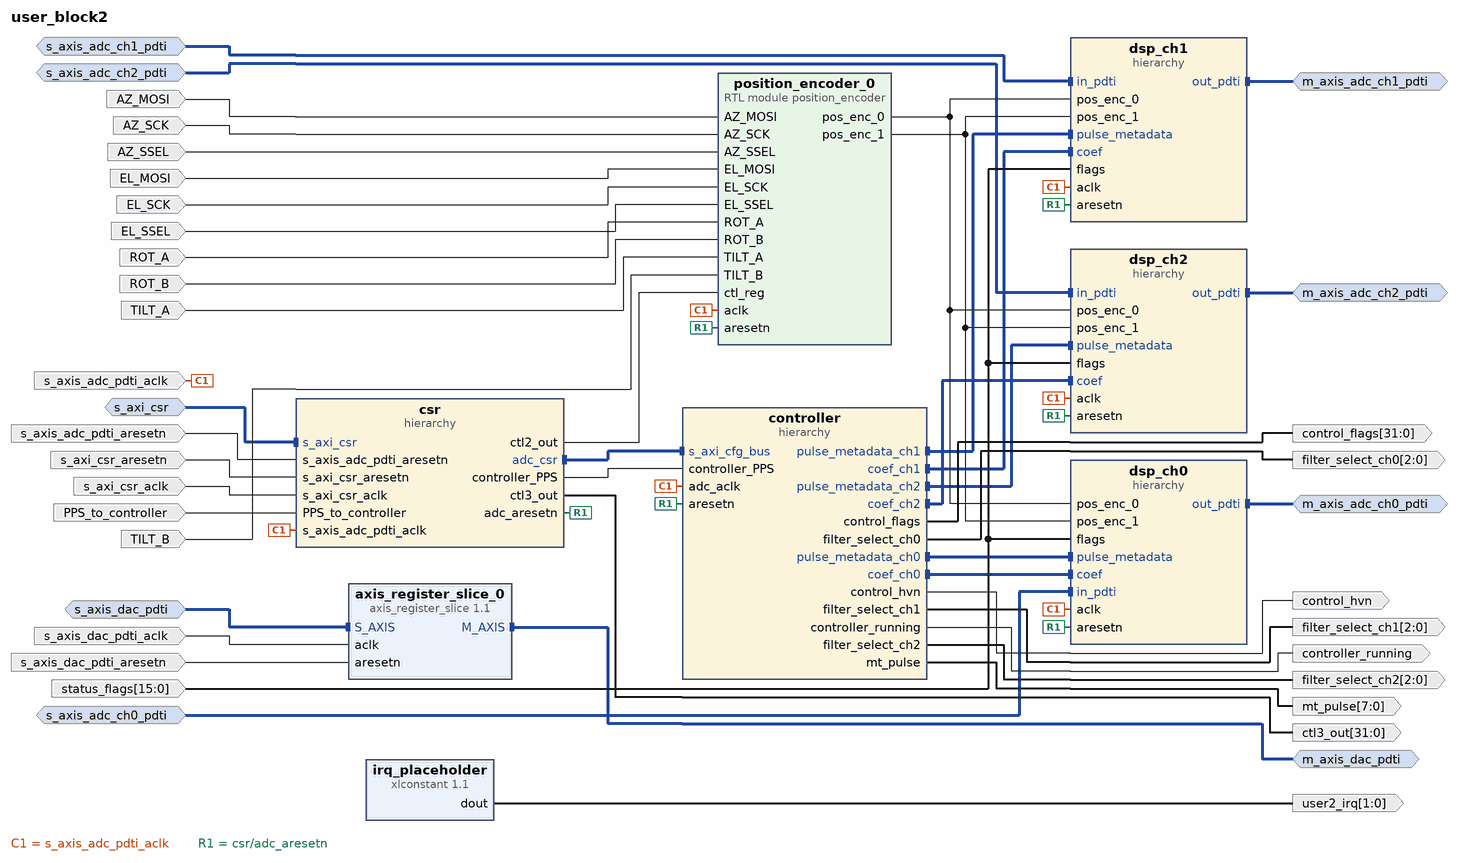
[diagram p0: block diagram of the top level]
# Vivado block design user_block2, xcku060-ffva1156-2-e, Vivado 2019.2
create_bd_design user_block2

create_bd_intf_port -mode Master -vlnv xilinx.com:interface:axis_rtl:1.0 m_axis_adc_ch0_pdti
set_property -dict [list \
  CONFIG.FREQ_HZ 200000000 \
  CONFIG.CLK_DOMAIN user_block2_s_axis_adc_pdti_aclk \
] [get_bd_intf_ports m_axis_adc_ch0_pdti]
create_bd_intf_port -mode Slave -vlnv xilinx.com:interface:axis_rtl:1.0 s_axis_adc_ch0_pdti
set_property -dict [list \
  CONFIG.TDATA_NUM_BYTES 4 \
  CONFIG.TDEST_WIDTH 0 \
  CONFIG.TID_WIDTH 0 \
  CONFIG.TUSER_WIDTH 128 \
  CONFIG.HAS_TREADY 0 \
  CONFIG.HAS_TSTRB 0 \
  CONFIG.HAS_TKEEP 0 \
  CONFIG.HAS_TLAST 0 \
  CONFIG.FREQ_HZ 200000000 \
  CONFIG.CLK_DOMAIN user_block2_s_axis_adc_pdti_aclk \
  CONFIG.LAYERED_METADATA undef \
] [get_bd_intf_ports s_axis_adc_ch0_pdti]
create_bd_intf_port -mode Slave -vlnv xilinx.com:interface:aximm_rtl:1.0 s_axi_csr
set_property -dict [list \
  CONFIG.DATA_WIDTH 32 \
  CONFIG.PROTOCOL AXI4LITE \
  CONFIG.FREQ_HZ 250000000 \
  CONFIG.ID_WIDTH 0 \
  CONFIG.ADDR_WIDTH 26 \
  CONFIG.AWUSER_WIDTH 0 \
  CONFIG.ARUSER_WIDTH 0 \
  CONFIG.WUSER_WIDTH 0 \
  CONFIG.RUSER_WIDTH 0 \
  CONFIG.BUSER_WIDTH 0 \
  CONFIG.READ_WRITE_MODE READ_WRITE \
  CONFIG.HAS_BURST 0 \
  CONFIG.HAS_LOCK 0 \
  CONFIG.HAS_PROT 1 \
  CONFIG.HAS_CACHE 0 \
  CONFIG.HAS_QOS 0 \
  CONFIG.HAS_REGION 0 \
  CONFIG.HAS_WSTRB 1 \
  CONFIG.HAS_BRESP 1 \
  CONFIG.HAS_RRESP 1 \
  CONFIG.SUPPORTS_NARROW_BURST 0 \
  CONFIG.NUM_READ_OUTSTANDING 1 \
  CONFIG.NUM_WRITE_OUTSTANDING 1 \
  CONFIG.MAX_BURST_LENGTH 1 \
  CONFIG.NUM_READ_THREADS 1 \
  CONFIG.NUM_WRITE_THREADS 1 \
  CONFIG.RUSER_BITS_PER_BYTE 0 \
  CONFIG.WUSER_BITS_PER_BYTE 0 \
] [get_bd_intf_ports s_axi_csr]
create_bd_intf_port -mode Master -vlnv xilinx.com:interface:axis_rtl:1.0 m_axis_adc_ch1_pdti
set_property -dict [list \
  CONFIG.FREQ_HZ 200000000 \
  CONFIG.CLK_DOMAIN user_block2_s_axis_adc_pdti_aclk \
] [get_bd_intf_ports m_axis_adc_ch1_pdti]
create_bd_intf_port -mode Slave -vlnv xilinx.com:interface:axis_rtl:1.0 s_axis_adc_ch1_pdti
set_property -dict [list \
  CONFIG.TDATA_NUM_BYTES 4 \
  CONFIG.TDEST_WIDTH 0 \
  CONFIG.TID_WIDTH 0 \
  CONFIG.TUSER_WIDTH 128 \
  CONFIG.HAS_TREADY 0 \
  CONFIG.HAS_TSTRB 0 \
  CONFIG.HAS_TKEEP 0 \
  CONFIG.HAS_TLAST 0 \
  CONFIG.FREQ_HZ 200000000 \
  CONFIG.CLK_DOMAIN user_block2_s_axis_adc_pdti_aclk \
  CONFIG.LAYERED_METADATA undef \
] [get_bd_intf_ports s_axis_adc_ch1_pdti]
create_bd_intf_port -mode Master -vlnv xilinx.com:interface:axis_rtl:1.0 m_axis_adc_ch2_pdti
set_property -dict [list \
  CONFIG.FREQ_HZ 200000000 \
  CONFIG.CLK_DOMAIN user_block2_s_axis_adc_pdti_aclk \
] [get_bd_intf_ports m_axis_adc_ch2_pdti]
create_bd_intf_port -mode Slave -vlnv xilinx.com:interface:axis_rtl:1.0 s_axis_adc_ch2_pdti
set_property -dict [list \
  CONFIG.TDATA_NUM_BYTES 4 \
  CONFIG.TDEST_WIDTH 0 \
  CONFIG.TID_WIDTH 0 \
  CONFIG.TUSER_WIDTH 128 \
  CONFIG.HAS_TREADY 0 \
  CONFIG.HAS_TSTRB 0 \
  CONFIG.HAS_TKEEP 0 \
  CONFIG.HAS_TLAST 0 \
  CONFIG.FREQ_HZ 200000000 \
  CONFIG.CLK_DOMAIN user_block2_s_axis_adc_pdti_aclk \
  CONFIG.LAYERED_METADATA undef \
] [get_bd_intf_ports s_axis_adc_ch2_pdti]
create_bd_intf_port -mode Master -vlnv xilinx.com:interface:axis_rtl:1.0 m_axis_dac_pdti
set_property -dict [list \
  CONFIG.FREQ_HZ 250000000 \
  CONFIG.CLK_DOMAIN user_block2_s_axis_dac_pdti_aclk \
] [get_bd_intf_ports m_axis_dac_pdti]
create_bd_intf_port -mode Slave -vlnv xilinx.com:interface:axis_rtl:1.0 s_axis_dac_pdti
set_property -dict [list \
  CONFIG.TDATA_NUM_BYTES 4 \
  CONFIG.TDEST_WIDTH 0 \
  CONFIG.TID_WIDTH 0 \
  CONFIG.TUSER_WIDTH 128 \
  CONFIG.HAS_TREADY 0 \
  CONFIG.HAS_TSTRB 0 \
  CONFIG.HAS_TKEEP 0 \
  CONFIG.HAS_TLAST 0 \
  CONFIG.FREQ_HZ 250000000 \
  CONFIG.CLK_DOMAIN user_block2_s_axis_dac_pdti_aclk \
  CONFIG.LAYERED_METADATA undef \
] [get_bd_intf_ports s_axis_dac_pdti]
create_bd_port -dir O -from 1 -to 0 user2_irq
create_bd_port -dir I -type clk s_axis_adc_pdti_aclk
set_property -dict [list \
  CONFIG.ASSOCIATED_BUSIF s_axis_adc_ch1_pdti:s_axis_adc_ch2_pdti:m_axis_adc_ch0_pdti:m_axis_adc_ch1_pdti:m_axis_adc_ch2_pdti:s_axis_adc_ch0_pdti \
  CONFIG.ASSOCIATED_RESET s_axis_adc_pdti_aresetn \
  CONFIG.CLK_DOMAIN user_block2_s_axis_adc_pdti_aclk \
  CONFIG.FREQ_HZ 200000000 \
] [get_bd_ports s_axis_adc_pdti_aclk]
create_bd_port -dir O -from 2 -to 0 -type data filter_select_ch0
create_bd_port -dir O -from 2 -to 0 -type data filter_select_ch1
create_bd_port -dir O -from 2 -to 0 -type data filter_select_ch2
create_bd_port -dir O -from 31 -to 0 -type data control_flags
create_bd_port -dir O -from 7 -to 0 -type data mt_pulse
create_bd_port -dir I -from 15 -to 0 -type data status_flags
set_property -dict [list \
  CONFIG.LAYERED_METADATA {xilinx.com:interface:datatypes:1.0 {DATA {datatype {name {attribs {resolve_type immediate dependency {} format string minimum {} maximum {}} value {}} bitwidth {attribs {resolve_type immediate dependency {} format long minimum {} maximum {}} value 32} bitoffset {attribs {resolve_type immediate dependency {} format long minimum {} maximum {}} value 0} integer {signed {attribs {resolve_type immediate dependency {} format bool minimum {} maximum {}} value false}}}}}} \
] [get_bd_ports status_flags]
create_bd_port -dir I -type rst s_axis_adc_pdti_aresetn
create_bd_port -dir I -type rst s_axi_csr_aresetn
create_bd_port -dir I -type clk s_axi_csr_aclk
set_property -dict [list \
  CONFIG.ASSOCIATED_BUSIF s_axi_csr \
  CONFIG.ASSOCIATED_RESET s_axi_csr_aresetn \
  CONFIG.FREQ_HZ 250000000 \
] [get_bd_ports s_axi_csr_aclk]
create_bd_port -dir I PPS_to_controller
create_bd_port -dir I AZ_MOSI
create_bd_port -dir I AZ_SCK
create_bd_port -dir I AZ_SSEL
create_bd_port -dir I EL_MOSI
create_bd_port -dir I EL_SCK
create_bd_port -dir I EL_SSEL
create_bd_port -dir I ROT_A
create_bd_port -dir I ROT_B
create_bd_port -dir I TILT_A
create_bd_port -dir I TILT_B
create_bd_port -dir I -type clk s_axis_dac_pdti_aclk
set_property -dict [list \
  CONFIG.ASSOCIATED_BUSIF s_axis_dac_pdti:m_axis_dac_pdti \
  CONFIG.ASSOCIATED_RESET s_axis_dac_pdti_aresetn \
  CONFIG.CLK_DOMAIN user_block2_s_axis_dac_pdti_aclk \
  CONFIG.FREQ_HZ 250000000 \
] [get_bd_ports s_axis_dac_pdti_aclk]
create_bd_port -dir I -type rst s_axis_dac_pdti_aresetn
create_bd_port -dir O -from 31 -to 0 ctl3_out
create_bd_port -dir O controller_running
create_bd_port -dir O -type data control_hvn

create_bd_cell -type hier dsp_ch0
create_bd_cell -type hier dsp_ch2
create_bd_cell -type hier controller
create_bd_cell -type hier csr
create_bd_cell -type module -reference position_encoder position_encoder_0
create_bd_cell -type hier dsp_ch1
create_bd_cell -type ip -vlnv xilinx.com:ip:axis_register_slice:1.1 axis_register_slice_0
create_bd_cell -type ip -vlnv xilinx.com:ip:xlconstant:1.1 irq_placeholder
set_property -dict {CONFIG.CONST_VAL 0 CONFIG.CONST_WIDTH 2} [get_bd_cells irq_placeholder]

# ---- hierarchy /dsp_ch0 ----
current_bd_instance /dsp_ch0
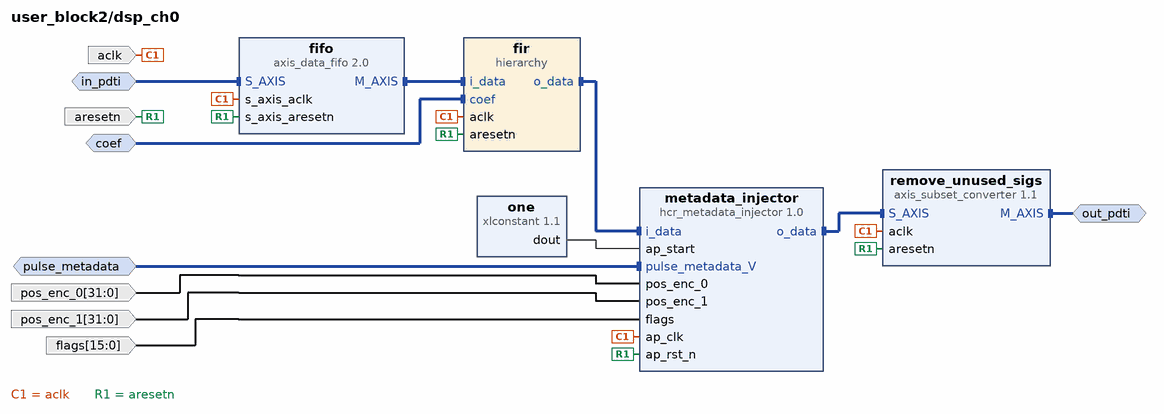
[diagram p1: block diagram inside /dsp_ch0]
create_bd_intf_pin -mode Master -vlnv xilinx.com:interface:axis_rtl:1.0 out_pdti
create_bd_intf_pin -mode Slave -vlnv xilinx.com:interface:axis_rtl:1.0 coef
create_bd_intf_pin -mode Slave -vlnv xilinx.com:interface:axis_rtl:1.0 in_pdti
create_bd_intf_pin -mode Slave -vlnv xilinx.com:interface:axis_rtl:1.0 pulse_metadata
create_bd_pin -dir I -type clk aclk
create_bd_pin -dir I -type rst aresetn
create_bd_pin -dir I -from 31 -to 0 -type data pos_enc_0
create_bd_pin -dir I -from 31 -to 0 -type data pos_enc_1
create_bd_pin -dir I -from 15 -to 0 -type data flags

create_bd_cell -type hier fir
create_bd_cell -type ip -vlnv xilinx.com:ip:axis_data_fifo:2.0 fifo
set_property -dict {CONFIG.FIFO_DEPTH 16 CONFIG.HAS_RD_DATA_COUNT 1 CONFIG.HAS_WR_DATA_COUNT 1} [get_bd_cells fifo]
create_bd_cell -type ip -vlnv xilinx.com:ip:axis_subset_converter:1.1 remove_unused_sigs
set_property -dict [list \
  CONFIG.M_HAS_TKEEP 0 \
  CONFIG.M_HAS_TLAST 0 \
  CONFIG.M_HAS_TREADY 0 \
  CONFIG.M_HAS_TSTRB 0 \
  CONFIG.M_TDEST_WIDTH 0 \
  CONFIG.M_TID_WIDTH 0 \
  CONFIG.TDATA_REMAP {tdata[31:0]} \
  CONFIG.TUSER_REMAP {tuser[127:0]} \
] [get_bd_cells remove_unused_sigs]
create_bd_cell -type ip -vlnv xilinx.com:ip:xlconstant:1.1 one
create_bd_cell -type ip -vlnv NCAR:EOL:hcr_metadata_injector:1.0 metadata_injector

# ---- hierarchy /dsp_ch0/fir ----
current_bd_instance /dsp_ch0/fir
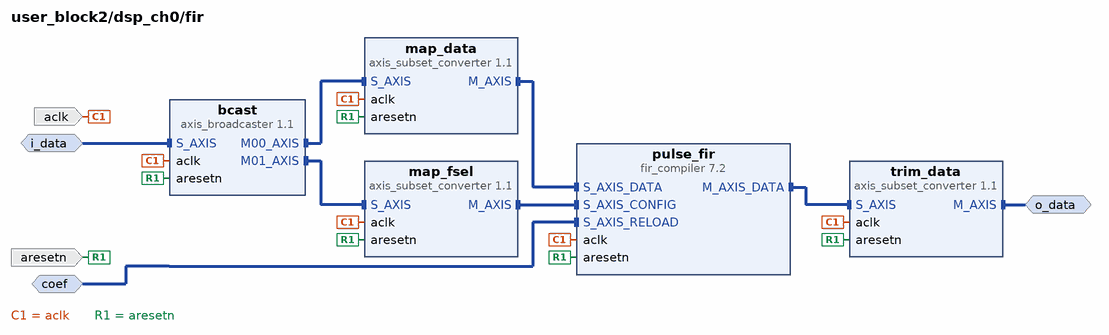
[diagram p2: block diagram inside /dsp_ch0/fir]
create_bd_intf_pin -mode Master -vlnv xilinx.com:interface:axis_rtl:1.0 o_data
create_bd_intf_pin -mode Slave -vlnv xilinx.com:interface:axis_rtl:1.0 coef
create_bd_intf_pin -mode Slave -vlnv xilinx.com:interface:axis_rtl:1.0 i_data
create_bd_pin -dir I -type clk aclk
create_bd_pin -dir I -type rst aresetn

create_bd_cell -type ip -vlnv xilinx.com:ip:axis_broadcaster:1.1 bcast
set_property -dict [list \
  CONFIG.M00_TDATA_REMAP {tdata[31:0]} \
  CONFIG.M00_TUSER_REMAP {tuser[127:0]} \
  CONFIG.M01_TDATA_REMAP {tdata[31:0]} \
  CONFIG.M01_TUSER_REMAP {tuser[127:0]} \
] [get_bd_cells bcast]
create_bd_cell -type ip -vlnv xilinx.com:ip:axis_subset_converter:1.1 map_fsel
set_property -dict [list \
  CONFIG.M_HAS_TKEEP 0 \
  CONFIG.M_HAS_TLAST 0 \
  CONFIG.M_HAS_TREADY 1 \
  CONFIG.M_HAS_TSTRB 0 \
  CONFIG.M_TDATA_NUM_BYTES 1 \
  CONFIG.M_TDEST_WIDTH 0 \
  CONFIG.M_TID_WIDTH 0 \
  CONFIG.M_TUSER_WIDTH 0 \
  CONFIG.S_HAS_TKEEP 0 \
  CONFIG.S_HAS_TLAST 0 \
  CONFIG.S_HAS_TREADY 1 \
  CONFIG.S_HAS_TSTRB 0 \
  CONFIG.S_TDATA_NUM_BYTES 4 \
  CONFIG.S_TDEST_WIDTH 0 \
  CONFIG.S_TID_WIDTH 0 \
  CONFIG.S_TUSER_WIDTH 128 \
  CONFIG.TDATA_REMAP {5'b0,tuser[31:29]} \
  CONFIG.TUSER_REMAP {1'b0} \
] [get_bd_cells map_fsel]
create_bd_cell -type ip -vlnv xilinx.com:ip:axis_subset_converter:1.1 trim_data
set_property -dict [list \
  CONFIG.M_TDATA_NUM_BYTES 4 \
  CONFIG.S_TDATA_NUM_BYTES 6 \
  CONFIG.TDATA_REMAP {tdata[39:24],tdata[15:0]} \
  CONFIG.TUSER_REMAP {tuser[127:0]} \
] [get_bd_cells trim_data]
create_bd_cell -type ip -vlnv xilinx.com:ip:axis_subset_converter:1.1 map_data
set_property -dict [list \
  CONFIG.M_HAS_TKEEP 0 \
  CONFIG.M_HAS_TLAST 0 \
  CONFIG.M_HAS_TREADY 1 \
  CONFIG.M_HAS_TSTRB 0 \
  CONFIG.M_TDATA_NUM_BYTES 4 \
  CONFIG.M_TDEST_WIDTH 0 \
  CONFIG.M_TID_WIDTH 0 \
  CONFIG.M_TUSER_WIDTH 128 \
  CONFIG.S_HAS_TKEEP 0 \
  CONFIG.S_HAS_TLAST 0 \
  CONFIG.S_HAS_TREADY 1 \
  CONFIG.S_HAS_TSTRB 0 \
  CONFIG.S_TDATA_NUM_BYTES 4 \
  CONFIG.S_TDEST_WIDTH 0 \
  CONFIG.S_TID_WIDTH 0 \
  CONFIG.S_TUSER_WIDTH 128 \
  CONFIG.TDATA_REMAP {tdata[31:0]} \
  CONFIG.TUSER_REMAP {tuser[127:32],3'b0,tuser[28:0]} \
] [get_bd_cells map_data]
create_bd_cell -type ip -vlnv xilinx.com:ip:fir_compiler:7.2 pulse_fir
set_property -dict [list \
  CONFIG.Blank_Output false \
  CONFIG.CoefficientVector 1,1,1,1,1,1,1,1,1,1,1,1,1,1,1,1,1,1,1,1,1,1,1,1,1,1,1,1,1,1,1,1,1,1,1,1,1,1,1,1,1,1,1,1,1,1,1,1,1,1,1,1,1,1,1,1,1,1,1,1,1,1,1,1,1,1,1,1,1,1,1,1,1,1,1,1,1,1,1,1,1,1,1,1,1,1,1,1,1,1,1,1,1,1,1,1,1,1,1,1,1,1,1,1,1,1,1,1,1,1,1,1,1,1,1,1,1,1,1,1,1,1,1,1,1,1,1,1,1,1,1,1,1,1,1,1,1,1,1,1,1,1,1,1,1,1,1,1,1,1,1,1,1,1,1,1,1,1,1,1,1,1,1,1,1,1,1,1,1,1,1,1,1,1,1,1,1,1,1,1,1,1,1,1,1,1,1,1,1,1,1,1,1,1,1,1,1,1,1,1,1,1,1,1,1,1,1,1,1,1,1,1,1,1,1,1,1,1,1,1,1,1,1,1,1,1,1,1,1,1,1,1,1,1,1,1,1,1,1,1,1,1,1,1,1,1,1,1,1,1,1,1,1,1,1,1,1,1,1,1,1,1,1,1,1,1,1,1,1,1,1,1,1,1,1,1,1,1,1,1,1,1,1,1,1,1,1,1,1,1,1,1,1,1,1,1,1,1,1,1,1,1,1,1,1,1,1,1,1,1,1,1,1,1,1,1,1,1,1,1,1,1,1,1,1,1,1,1,1,1,1,1,1,1,1,1,1,1,1,1,1,1,1,1,1,1,1,1,1,1,1,1,1,1,1,1,1,1,1,1,1,1,1,1,1,1,1,1,1,1,1,1,1,1,1,1,1,1,1,1,1,1,1,1 \
  CONFIG.Coefficient_Fractional_Bits 22 \
  CONFIG.Coefficient_Reload true \
  CONFIG.Coefficient_Sets 8 \
  CONFIG.Coefficient_Sign Signed \
  CONFIG.Coefficient_Structure Non_Symmetric \
  CONFIG.Coefficient_Width 24 \
  CONFIG.ColumnConfig 48 \
  CONFIG.DATA_Has_TLAST Not_Required \
  CONFIG.DATA_TUSER_Width 128 \
  CONFIG.Data_Fractional_Bits 15 \
  CONFIG.Data_Width 16 \
  CONFIG.DisplayReloadOrder true \
  CONFIG.Filter_Architecture Systolic_Multiply_Accumulate \
  CONFIG.Has_ARESETn true \
  CONFIG.M_DATA_Has_TREADY true \
  CONFIG.M_DATA_Has_TUSER User_Field \
  CONFIG.Num_Reload_Slots 4 \
  CONFIG.Number_Channels 1 \
  CONFIG.Number_Paths 2 \
  CONFIG.Output_Rounding_Mode Symmetric_Rounding_to_Zero \
  CONFIG.Output_Width 24 \
  CONFIG.Quantization Quantize_Only \
  CONFIG.RateSpecification Input_Sample_Period \
  CONFIG.Reset_Data_Vector true \
  CONFIG.S_DATA_Has_FIFO true \
  CONFIG.S_DATA_Has_TUSER User_Field \
  CONFIG.SamplePeriod 1 \
  CONFIG.Select_Pattern All \
] [get_bd_cells pulse_fir]

# ---- hierarchy /dsp_ch2 ----
current_bd_instance /dsp_ch2
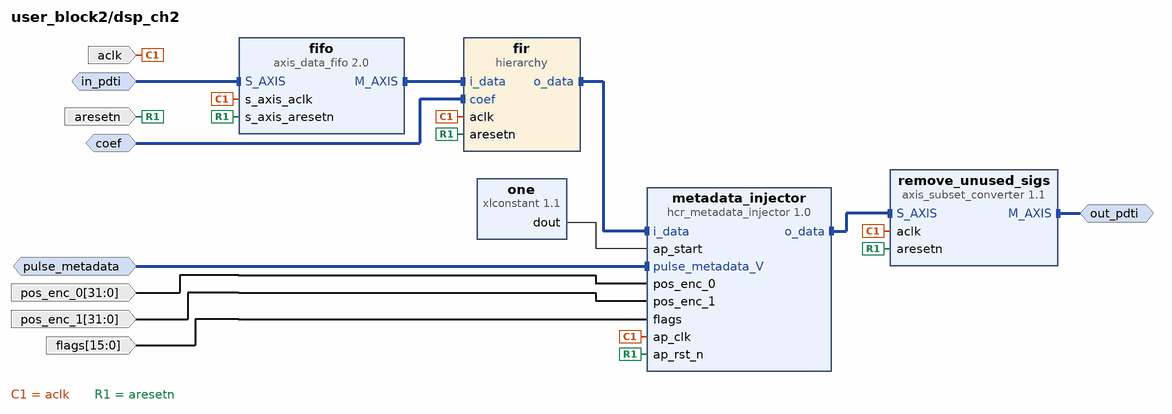
[diagram p3: block diagram inside /dsp_ch2]
create_bd_intf_pin -mode Master -vlnv xilinx.com:interface:axis_rtl:1.0 out_pdti
create_bd_intf_pin -mode Slave -vlnv xilinx.com:interface:axis_rtl:1.0 coef
create_bd_intf_pin -mode Slave -vlnv xilinx.com:interface:axis_rtl:1.0 in_pdti
create_bd_intf_pin -mode Slave -vlnv xilinx.com:interface:axis_rtl:1.0 pulse_metadata
create_bd_pin -dir I -type clk aclk
create_bd_pin -dir I -type rst aresetn
create_bd_pin -dir I -from 31 -to 0 -type data pos_enc_0
create_bd_pin -dir I -from 31 -to 0 -type data pos_enc_1
create_bd_pin -dir I -from 15 -to 0 -type data flags

create_bd_cell -type hier fir
create_bd_cell -type ip -vlnv xilinx.com:ip:axis_subset_converter:1.1 remove_unused_sigs
set_property -dict [list \
  CONFIG.M_HAS_TKEEP 0 \
  CONFIG.M_HAS_TLAST 0 \
  CONFIG.M_HAS_TREADY 0 \
  CONFIG.M_HAS_TSTRB 0 \
  CONFIG.M_TDEST_WIDTH 0 \
  CONFIG.M_TID_WIDTH 0 \
  CONFIG.TDATA_REMAP {tdata[31:0]} \
  CONFIG.TUSER_REMAP {tuser[127:0]} \
] [get_bd_cells remove_unused_sigs]
create_bd_cell -type ip -vlnv xilinx.com:ip:axis_data_fifo:2.0 fifo
set_property -dict {CONFIG.FIFO_DEPTH 16 CONFIG.HAS_RD_DATA_COUNT 1 CONFIG.HAS_WR_DATA_COUNT 1} [get_bd_cells fifo]
create_bd_cell -type ip -vlnv xilinx.com:ip:xlconstant:1.1 one
create_bd_cell -type ip -vlnv NCAR:EOL:hcr_metadata_injector:1.0 metadata_injector

# ---- hierarchy /dsp_ch2/fir ----
current_bd_instance /dsp_ch2/fir
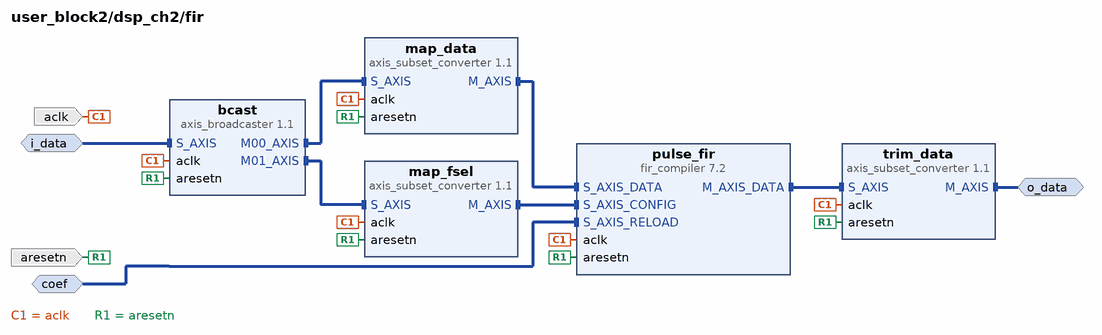
[diagram p4: block diagram inside /dsp_ch2/fir]
create_bd_intf_pin -mode Master -vlnv xilinx.com:interface:axis_rtl:1.0 o_data
create_bd_intf_pin -mode Slave -vlnv xilinx.com:interface:axis_rtl:1.0 coef
create_bd_intf_pin -mode Slave -vlnv xilinx.com:interface:axis_rtl:1.0 i_data
create_bd_pin -dir I -type clk aclk
create_bd_pin -dir I -type rst aresetn

create_bd_cell -type ip -vlnv xilinx.com:ip:axis_subset_converter:1.1 trim_data
set_property -dict [list \
  CONFIG.M_TDATA_NUM_BYTES 4 \
  CONFIG.S_TDATA_NUM_BYTES 6 \
  CONFIG.TDATA_REMAP {tdata[39:24],tdata[15:0]} \
  CONFIG.TUSER_REMAP {tuser[127:0]} \
] [get_bd_cells trim_data]
create_bd_cell -type ip -vlnv xilinx.com:ip:axis_broadcaster:1.1 bcast
set_property -dict [list \
  CONFIG.M00_TDATA_REMAP {tdata[31:0]} \
  CONFIG.M00_TUSER_REMAP {tuser[127:0]} \
  CONFIG.M01_TDATA_REMAP {tdata[31:0]} \
  CONFIG.M01_TUSER_REMAP {tuser[127:0]} \
] [get_bd_cells bcast]
create_bd_cell -type ip -vlnv xilinx.com:ip:axis_subset_converter:1.1 map_fsel
set_property -dict [list \
  CONFIG.M_HAS_TKEEP 0 \
  CONFIG.M_HAS_TLAST 0 \
  CONFIG.M_HAS_TREADY 1 \
  CONFIG.M_HAS_TSTRB 0 \
  CONFIG.M_TDATA_NUM_BYTES 1 \
  CONFIG.M_TDEST_WIDTH 0 \
  CONFIG.M_TID_WIDTH 0 \
  CONFIG.M_TUSER_WIDTH 0 \
  CONFIG.S_HAS_TKEEP 0 \
  CONFIG.S_HAS_TLAST 0 \
  CONFIG.S_HAS_TREADY 1 \
  CONFIG.S_HAS_TSTRB 0 \
  CONFIG.S_TDATA_NUM_BYTES 4 \
  CONFIG.S_TDEST_WIDTH 0 \
  CONFIG.S_TID_WIDTH 0 \
  CONFIG.S_TUSER_WIDTH 128 \
  CONFIG.TDATA_REMAP {5'b0,tuser[31:29]} \
  CONFIG.TUSER_REMAP {1'b0} \
] [get_bd_cells map_fsel]
create_bd_cell -type ip -vlnv xilinx.com:ip:axis_subset_converter:1.1 map_data
set_property -dict [list \
  CONFIG.M_HAS_TKEEP 0 \
  CONFIG.M_HAS_TLAST 0 \
  CONFIG.M_HAS_TREADY 1 \
  CONFIG.M_HAS_TSTRB 0 \
  CONFIG.M_TDATA_NUM_BYTES 4 \
  CONFIG.M_TDEST_WIDTH 0 \
  CONFIG.M_TID_WIDTH 0 \
  CONFIG.M_TUSER_WIDTH 128 \
  CONFIG.S_HAS_TKEEP 0 \
  CONFIG.S_HAS_TLAST 0 \
  CONFIG.S_HAS_TREADY 1 \
  CONFIG.S_HAS_TSTRB 0 \
  CONFIG.S_TDATA_NUM_BYTES 4 \
  CONFIG.S_TDEST_WIDTH 0 \
  CONFIG.S_TID_WIDTH 0 \
  CONFIG.S_TUSER_WIDTH 128 \
  CONFIG.TDATA_REMAP {tdata[31:0]} \
  CONFIG.TUSER_REMAP {tuser[127:32],3'b0,tuser[28:0]} \
] [get_bd_cells map_data]
create_bd_cell -type ip -vlnv xilinx.com:ip:fir_compiler:7.2 pulse_fir
set_property -dict [list \
  CONFIG.Blank_Output false \
  CONFIG.CoefficientVector 1,1,1,1,1,1,1,1,1,1,1,1,1,1,1,1,1,1,1,1,1,1,1,1,1,1,1,1,1,1,1,1,1,1,1,1,1,1,1,1,1,1,1,1,1,1,1,1,1,1,1,1,1,1,1,1,1,1,1,1,1,1,1,1,1,1,1,1,1,1,1,1,1,1,1,1,1,1,1,1,1,1,1,1,1,1,1,1,1,1,1,1,1,1,1,1,1,1,1,1,1,1,1,1,1,1,1,1,1,1,1,1,1,1,1,1,1,1,1,1,1,1,1,1,1,1,1,1,1,1,1,1,1,1,1,1,1,1,1,1,1,1,1,1,1,1,1,1,1,1,1,1,1,1,1,1,1,1,1,1,1,1,1,1,1,1,1,1,1,1,1,1,1,1,1,1,1,1,1,1,1,1,1,1,1,1,1,1,1,1,1,1,1,1,1,1,1,1,1,1,1,1,1,1,1,1,1,1,1,1,1,1,1,1,1,1,1,1,1,1,1,1,1,1,1,1,1,1,1,1,1,1,1,1,1,1,1,1,1,1,1,1,1,1,1,1,1,1,1,1,1,1,1,1,1,1,1,1,1,1,1,1,1,1,1,1,1,1,1,1,1,1,1,1,1,1,1,1,1,1,1,1,1,1,1,1,1,1,1,1,1,1,1,1,1,1,1,1,1,1,1,1,1,1,1,1,1,1,1,1,1,1,1,1,1,1,1,1,1,1,1,1,1,1,1,1,1,1,1,1,1,1,1,1,1,1,1,1,1,1,1,1,1,1,1,1,1,1,1,1,1,1,1,1,1,1,1,1,1,1,1,1,1,1,1,1,1,1,1,1,1,1,1,1,1,1,1,1,1,1,1,1,1,1 \
  CONFIG.Coefficient_Fractional_Bits 22 \
  CONFIG.Coefficient_Reload true \
  CONFIG.Coefficient_Sets 8 \
  CONFIG.Coefficient_Sign Signed \
  CONFIG.Coefficient_Structure Non_Symmetric \
  CONFIG.Coefficient_Width 24 \
  CONFIG.ColumnConfig 48 \
  CONFIG.DATA_Has_TLAST Not_Required \
  CONFIG.DATA_TUSER_Width 128 \
  CONFIG.Data_Fractional_Bits 15 \
  CONFIG.Data_Width 16 \
  CONFIG.DisplayReloadOrder true \
  CONFIG.Filter_Architecture Systolic_Multiply_Accumulate \
  CONFIG.Has_ARESETn true \
  CONFIG.M_DATA_Has_TREADY true \
  CONFIG.M_DATA_Has_TUSER User_Field \
  CONFIG.Num_Reload_Slots 4 \
  CONFIG.Number_Channels 1 \
  CONFIG.Number_Paths 2 \
  CONFIG.Output_Rounding_Mode Symmetric_Rounding_to_Zero \
  CONFIG.Output_Width 24 \
  CONFIG.Quantization Quantize_Only \
  CONFIG.RateSpecification Input_Sample_Period \
  CONFIG.Reset_Data_Vector true \
  CONFIG.S_DATA_Has_FIFO true \
  CONFIG.S_DATA_Has_TUSER User_Field \
  CONFIG.SamplePeriod 1 \
  CONFIG.Select_Pattern All \
] [get_bd_cells pulse_fir]

# ---- hierarchy /controller ----
current_bd_instance /controller
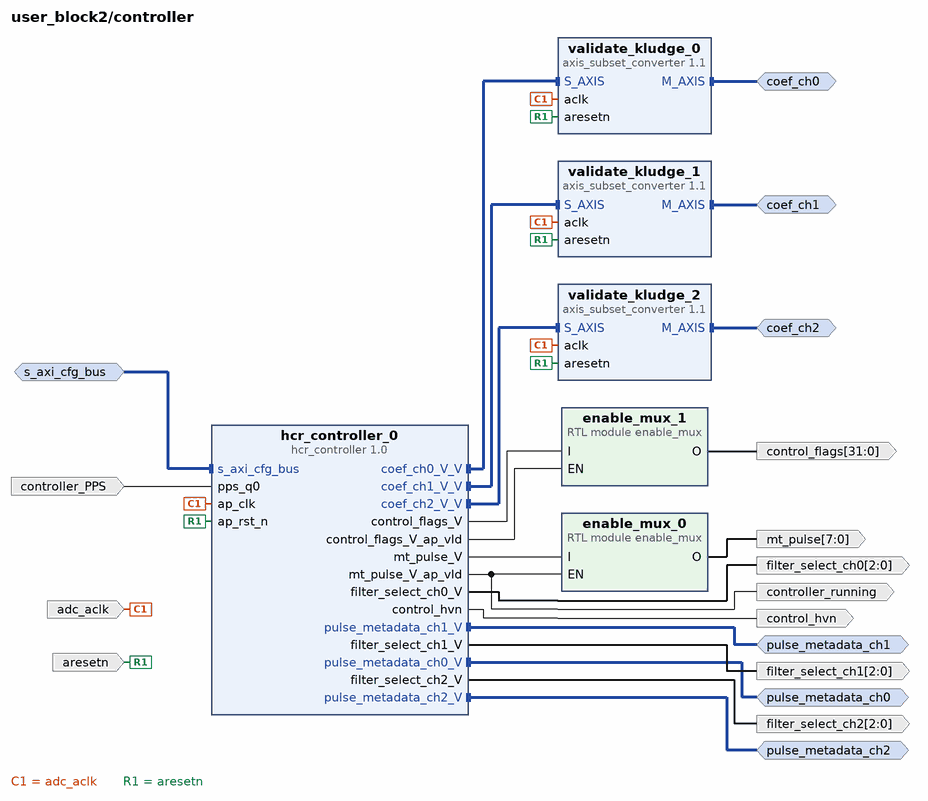
[diagram p5: block diagram inside /controller]
create_bd_intf_pin -mode Master -vlnv xilinx.com:interface:axis_rtl:1.0 coef_ch0
create_bd_intf_pin -mode Master -vlnv xilinx.com:interface:axis_rtl:1.0 coef_ch1
create_bd_intf_pin -mode Master -vlnv xilinx.com:interface:axis_rtl:1.0 coef_ch2
create_bd_intf_pin -mode Master -vlnv xilinx.com:interface:axis_rtl:1.0 pulse_metadata_ch0
create_bd_intf_pin -mode Master -vlnv xilinx.com:interface:axis_rtl:1.0 pulse_metadata_ch1
create_bd_intf_pin -mode Master -vlnv xilinx.com:interface:axis_rtl:1.0 pulse_metadata_ch2
create_bd_intf_pin -mode Slave -vlnv xilinx.com:interface:aximm_rtl:1.0 s_axi_cfg_bus
create_bd_pin -dir I -type clk adc_aclk
create_bd_pin -dir O -from 7 -to 0 -type data mt_pulse
create_bd_pin -dir O -from 31 -to 0 -type data control_flags
create_bd_pin -dir O -from 2 -to 0 -type data filter_select_ch0
create_bd_pin -dir O -from 2 -to 0 -type data filter_select_ch1
create_bd_pin -dir O -from 2 -to 0 -type data filter_select_ch2
create_bd_pin -dir I controller_PPS
create_bd_pin -dir I -type rst aresetn
create_bd_pin -dir O controller_running
create_bd_pin -dir O -type data control_hvn

create_bd_cell -type module -reference enable_mux enable_mux_0
set_property -dict {CONFIG.n 8} [get_bd_cells enable_mux_0]
create_bd_cell -type module -reference enable_mux enable_mux_1
create_bd_cell -type ip -vlnv xilinx.com:ip:axis_subset_converter:1.1 validate_kludge_0
set_property -dict {CONFIG.TDATA_REMAP {tdata[23:0]}} [get_bd_cells validate_kludge_0]
create_bd_cell -type ip -vlnv xilinx.com:ip:axis_subset_converter:1.1 validate_kludge_1
set_property -dict {CONFIG.TDATA_REMAP {tdata[23:0]}} [get_bd_cells validate_kludge_1]
create_bd_cell -type ip -vlnv xilinx.com:ip:axis_subset_converter:1.1 validate_kludge_2
set_property -dict {CONFIG.TDATA_REMAP {tdata[23:0]}} [get_bd_cells validate_kludge_2]
create_bd_cell -type ip -vlnv NCAR:EOL:hcr_controller:1.0 hcr_controller_0

# ---- hierarchy /csr ----
current_bd_instance /csr
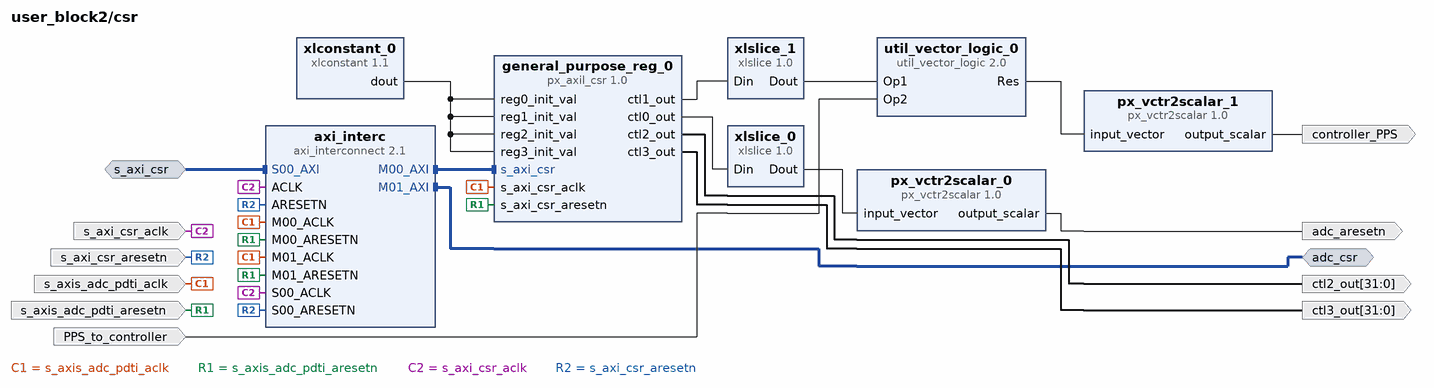
[diagram p6: block diagram inside /csr]
create_bd_intf_pin -mode Slave -vlnv xilinx.com:interface:aximm_rtl:1.0 s_axi_csr
create_bd_intf_pin -mode Master -vlnv xilinx.com:interface:aximm_rtl:1.0 adc_csr
create_bd_pin -dir I -type clk s_axis_adc_pdti_aclk
create_bd_pin -dir I -type rst s_axis_adc_pdti_aresetn
create_bd_pin -dir O adc_aresetn
create_bd_pin -dir I -type clk s_axi_csr_aclk
create_bd_pin -dir I -type rst s_axi_csr_aresetn
create_bd_pin -dir O controller_PPS
create_bd_pin -dir I PPS_to_controller
create_bd_pin -dir O -from 31 -to 0 ctl2_out
create_bd_pin -dir O -from 31 -to 0 ctl3_out

create_bd_cell -type ip -vlnv xilinx.com:ip:util_vector_logic:2.0 util_vector_logic_0
set_property -dict {CONFIG.C_OPERATION or CONFIG.C_SIZE 1} [get_bd_cells util_vector_logic_0]
create_bd_cell -type ip -vlnv xilinx.com:ip:axi_interconnect:2.1 axi_interc
set_property -dict [list \
  CONFIG.M00_HAS_REGSLICE 3 \
  CONFIG.M01_HAS_REGSLICE 3 \
  CONFIG.M02_HAS_REGSLICE 3 \
  CONFIG.M03_HAS_REGSLICE 3 \
  CONFIG.M04_HAS_REGSLICE 3 \
  CONFIG.NUM_MI 2 \
  CONFIG.S00_HAS_REGSLICE 1 \
  CONFIG.SYNCHRONIZATION_STAGES 2 \
] [get_bd_cells axi_interc]
create_bd_cell -type ip -vlnv pentek.com:px_ip:px_axil_csr:1.0 general_purpose_reg_0
set_property -dict [list \
  CONFIG.has_interrupt_regs false \
  CONFIG.num_ctl_regs 4 \
  CONFIG.num_stat_regs 0 \
] [get_bd_cells general_purpose_reg_0]
create_bd_cell -type ip -vlnv pentek.com:px_ip:px_vctr2scalar:1.0 px_vctr2scalar_0
set_property -dict {CONFIG.invert false} [get_bd_cells px_vctr2scalar_0]
create_bd_cell -type ip -vlnv pentek.com:px_ip:px_vctr2scalar:1.0 px_vctr2scalar_1
set_property -dict {CONFIG.invert false} [get_bd_cells px_vctr2scalar_1]
create_bd_cell -type ip -vlnv xilinx.com:ip:xlconstant:1.1 xlconstant_0
set_property -dict {CONFIG.CONST_VAL 0 CONFIG.CONST_WIDTH 32} [get_bd_cells xlconstant_0]
create_bd_cell -type ip -vlnv xilinx.com:ip:xlslice:1.0 xlslice_0
create_bd_cell -type ip -vlnv xilinx.com:ip:xlslice:1.0 xlslice_1

# ---- hierarchy /dsp_ch1 ----
current_bd_instance /dsp_ch1
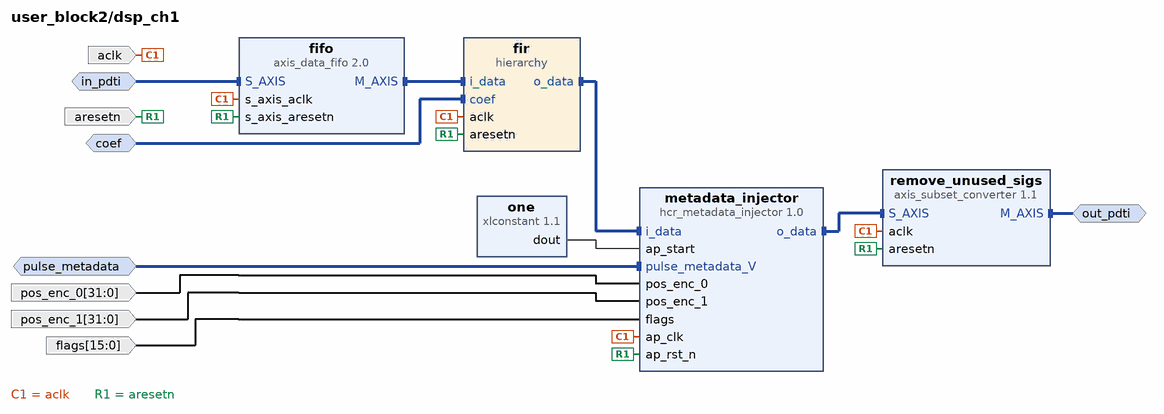
[diagram p7: block diagram inside /dsp_ch1]
create_bd_intf_pin -mode Master -vlnv xilinx.com:interface:axis_rtl:1.0 out_pdti
create_bd_intf_pin -mode Slave -vlnv xilinx.com:interface:axis_rtl:1.0 coef
create_bd_intf_pin -mode Slave -vlnv xilinx.com:interface:axis_rtl:1.0 in_pdti
create_bd_intf_pin -mode Slave -vlnv xilinx.com:interface:axis_rtl:1.0 pulse_metadata
create_bd_pin -dir I -type clk aclk
create_bd_pin -dir I -type rst aresetn
create_bd_pin -dir I -from 31 -to 0 -type data pos_enc_0
create_bd_pin -dir I -from 31 -to 0 -type data pos_enc_1
create_bd_pin -dir I -from 15 -to 0 -type data flags

create_bd_cell -type hier fir
create_bd_cell -type ip -vlnv xilinx.com:ip:axis_subset_converter:1.1 remove_unused_sigs
set_property -dict [list \
  CONFIG.M_HAS_TKEEP 0 \
  CONFIG.M_HAS_TLAST 0 \
  CONFIG.M_HAS_TREADY 0 \
  CONFIG.M_HAS_TSTRB 0 \
  CONFIG.M_TDEST_WIDTH 0 \
  CONFIG.M_TID_WIDTH 0 \
  CONFIG.TDATA_REMAP {tdata[31:0]} \
  CONFIG.TUSER_REMAP {tuser[127:0]} \
] [get_bd_cells remove_unused_sigs]
create_bd_cell -type ip -vlnv xilinx.com:ip:axis_data_fifo:2.0 fifo
set_property -dict {CONFIG.FIFO_DEPTH 16 CONFIG.HAS_RD_DATA_COUNT 1 CONFIG.HAS_WR_DATA_COUNT 1} [get_bd_cells fifo]
create_bd_cell -type ip -vlnv xilinx.com:ip:xlconstant:1.1 one
create_bd_cell -type ip -vlnv NCAR:EOL:hcr_metadata_injector:1.0 metadata_injector

# ---- hierarchy /dsp_ch1/fir ----
current_bd_instance /dsp_ch1/fir
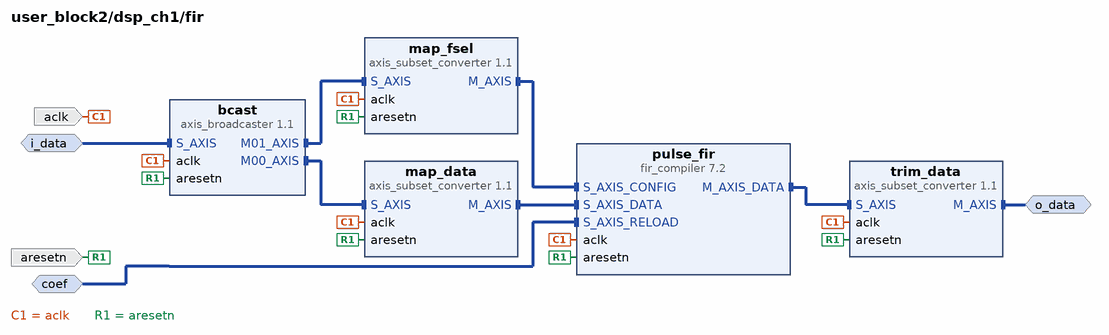
[diagram p8: block diagram inside /dsp_ch1/fir]
create_bd_intf_pin -mode Slave -vlnv xilinx.com:interface:axis_rtl:1.0 coef
create_bd_intf_pin -mode Slave -vlnv xilinx.com:interface:axis_rtl:1.0 i_data
create_bd_intf_pin -mode Master -vlnv xilinx.com:interface:axis_rtl:1.0 o_data
create_bd_pin -dir I -type clk aclk
create_bd_pin -dir I -type rst aresetn

create_bd_cell -type ip -vlnv xilinx.com:ip:axis_subset_converter:1.1 trim_data
set_property -dict [list \
  CONFIG.M_TDATA_NUM_BYTES 4 \
  CONFIG.S_TDATA_NUM_BYTES 6 \
  CONFIG.TDATA_REMAP {tdata[39:24],tdata[15:0]} \
  CONFIG.TUSER_REMAP {tuser[127:0]} \
] [get_bd_cells trim_data]
create_bd_cell -type ip -vlnv xilinx.com:ip:axis_broadcaster:1.1 bcast
set_property -dict [list \
  CONFIG.M00_TDATA_REMAP {tdata[31:0]} \
  CONFIG.M00_TUSER_REMAP {tuser[127:0]} \
  CONFIG.M01_TDATA_REMAP {tdata[31:0]} \
  CONFIG.M01_TUSER_REMAP {tuser[127:0]} \
] [get_bd_cells bcast]
create_bd_cell -type ip -vlnv xilinx.com:ip:axis_subset_converter:1.1 map_fsel
set_property -dict [list \
  CONFIG.M_HAS_TKEEP 0 \
  CONFIG.M_HAS_TLAST 0 \
  CONFIG.M_HAS_TREADY 1 \
  CONFIG.M_HAS_TSTRB 0 \
  CONFIG.M_TDATA_NUM_BYTES 1 \
  CONFIG.M_TDEST_WIDTH 0 \
  CONFIG.M_TID_WIDTH 0 \
  CONFIG.M_TUSER_WIDTH 0 \
  CONFIG.S_HAS_TKEEP 0 \
  CONFIG.S_HAS_TLAST 0 \
  CONFIG.S_HAS_TREADY 1 \
  CONFIG.S_HAS_TSTRB 0 \
  CONFIG.S_TDATA_NUM_BYTES 4 \
  CONFIG.S_TDEST_WIDTH 0 \
  CONFIG.S_TID_WIDTH 0 \
  CONFIG.S_TUSER_WIDTH 128 \
  CONFIG.TDATA_REMAP {5'b0,tuser[31:29]} \
  CONFIG.TUSER_REMAP {1'b0} \
] [get_bd_cells map_fsel]
create_bd_cell -type ip -vlnv xilinx.com:ip:axis_subset_converter:1.1 map_data
set_property -dict [list \
  CONFIG.M_HAS_TKEEP 0 \
  CONFIG.M_HAS_TLAST 0 \
  CONFIG.M_HAS_TREADY 1 \
  CONFIG.M_HAS_TSTRB 0 \
  CONFIG.M_TDATA_NUM_BYTES 4 \
  CONFIG.M_TDEST_WIDTH 0 \
  CONFIG.M_TID_WIDTH 0 \
  CONFIG.M_TUSER_WIDTH 128 \
  CONFIG.S_HAS_TKEEP 0 \
  CONFIG.S_HAS_TLAST 0 \
  CONFIG.S_HAS_TREADY 1 \
  CONFIG.S_HAS_TSTRB 0 \
  CONFIG.S_TDATA_NUM_BYTES 4 \
  CONFIG.S_TDEST_WIDTH 0 \
  CONFIG.S_TID_WIDTH 0 \
  CONFIG.S_TUSER_WIDTH 128 \
  CONFIG.TDATA_REMAP {tdata[31:0]} \
  CONFIG.TUSER_REMAP {tuser[127:32],3'b0,tuser[28:0]} \
] [get_bd_cells map_data]
create_bd_cell -type ip -vlnv xilinx.com:ip:fir_compiler:7.2 pulse_fir
set_property -dict [list \
  CONFIG.Blank_Output false \
  CONFIG.CoefficientVector 1,1,1,1,1,1,1,1,1,1,1,1,1,1,1,1,1,1,1,1,1,1,1,1,1,1,1,1,1,1,1,1,1,1,1,1,1,1,1,1,1,1,1,1,1,1,1,1,1,1,1,1,1,1,1,1,1,1,1,1,1,1,1,1,1,1,1,1,1,1,1,1,1,1,1,1,1,1,1,1,1,1,1,1,1,1,1,1,1,1,1,1,1,1,1,1,1,1,1,1,1,1,1,1,1,1,1,1,1,1,1,1,1,1,1,1,1,1,1,1,1,1,1,1,1,1,1,1,1,1,1,1,1,1,1,1,1,1,1,1,1,1,1,1,1,1,1,1,1,1,1,1,1,1,1,1,1,1,1,1,1,1,1,1,1,1,1,1,1,1,1,1,1,1,1,1,1,1,1,1,1,1,1,1,1,1,1,1,1,1,1,1,1,1,1,1,1,1,1,1,1,1,1,1,1,1,1,1,1,1,1,1,1,1,1,1,1,1,1,1,1,1,1,1,1,1,1,1,1,1,1,1,1,1,1,1,1,1,1,1,1,1,1,1,1,1,1,1,1,1,1,1,1,1,1,1,1,1,1,1,1,1,1,1,1,1,1,1,1,1,1,1,1,1,1,1,1,1,1,1,1,1,1,1,1,1,1,1,1,1,1,1,1,1,1,1,1,1,1,1,1,1,1,1,1,1,1,1,1,1,1,1,1,1,1,1,1,1,1,1,1,1,1,1,1,1,1,1,1,1,1,1,1,1,1,1,1,1,1,1,1,1,1,1,1,1,1,1,1,1,1,1,1,1,1,1,1,1,1,1,1,1,1,1,1,1,1,1,1,1,1,1,1,1,1,1,1,1,1,1,1,1,1,1 \
  CONFIG.Coefficient_Fractional_Bits 22 \
  CONFIG.Coefficient_Reload true \
  CONFIG.Coefficient_Sets 8 \
  CONFIG.Coefficient_Sign Signed \
  CONFIG.Coefficient_Structure Non_Symmetric \
  CONFIG.Coefficient_Width 24 \
  CONFIG.ColumnConfig 48 \
  CONFIG.DATA_Has_TLAST Not_Required \
  CONFIG.DATA_TUSER_Width 128 \
  CONFIG.Data_Fractional_Bits 15 \
  CONFIG.Data_Width 16 \
  CONFIG.DisplayReloadOrder true \
  CONFIG.Filter_Architecture Systolic_Multiply_Accumulate \
  CONFIG.Has_ARESETn true \
  CONFIG.M_DATA_Has_TREADY true \
  CONFIG.M_DATA_Has_TUSER User_Field \
  CONFIG.Num_Reload_Slots 4 \
  CONFIG.Number_Channels 1 \
  CONFIG.Number_Paths 2 \
  CONFIG.Output_Rounding_Mode Symmetric_Rounding_to_Zero \
  CONFIG.Output_Width 24 \
  CONFIG.Quantization Quantize_Only \
  CONFIG.RateSpecification Input_Sample_Period \
  CONFIG.Reset_Data_Vector true \
  CONFIG.S_DATA_Has_FIFO true \
  CONFIG.S_DATA_Has_TUSER User_Field \
  CONFIG.SamplePeriod 1 \
  CONFIG.Select_Pattern All \
] [get_bd_cells pulse_fir]

# ---- connections ----

current_bd_instance /dsp_ch0
connect_bd_intf_net [get_bd_intf_pins coef] [get_bd_intf_pins fir/coef]
connect_bd_intf_net [get_bd_intf_pins in_pdti] [get_bd_intf_pins fifo/S_AXIS]
connect_bd_intf_net [get_bd_intf_pins metadata_injector/o_data] [get_bd_intf_pins remove_unused_sigs/S_AXIS]
connect_bd_intf_net [get_bd_intf_pins fifo/M_AXIS] [get_bd_intf_pins fir/i_data]
connect_bd_intf_net [get_bd_intf_pins pulse_metadata] [get_bd_intf_pins metadata_injector/pulse_metadata_V]
connect_bd_intf_net [get_bd_intf_pins fir/o_data] [get_bd_intf_pins metadata_injector/i_data]
connect_bd_intf_net [get_bd_intf_pins out_pdti] [get_bd_intf_pins remove_unused_sigs/M_AXIS]
connect_bd_net -net s_axis_adc_pdti_aclk_1 [get_bd_pins aclk] \
  [get_bd_pins fir/aclk] [get_bd_pins fifo/s_axis_aclk] [get_bd_pins remove_unused_sigs/aclk] \
  [get_bd_pins metadata_injector/ap_clk]
connect_bd_net -net s_axis_adc_pdti_aresetn_1 [get_bd_pins aresetn] \
  [get_bd_pins fir/aresetn] [get_bd_pins fifo/s_axis_aresetn] [get_bd_pins remove_unused_sigs/aresetn] \
  [get_bd_pins metadata_injector/ap_rst_n]
connect_bd_net [get_bd_pins one/dout] [get_bd_pins metadata_injector/ap_start]
connect_bd_net -net pos_enc_0_1 [get_bd_pins pos_enc_0] [get_bd_pins metadata_injector/pos_enc_0]
connect_bd_net -net pos_enc_1_1 [get_bd_pins pos_enc_1] [get_bd_pins metadata_injector/pos_enc_1]
connect_bd_net [get_bd_pins flags] [get_bd_pins metadata_injector/flags]

current_bd_instance /dsp_ch0/fir
connect_bd_intf_net [get_bd_intf_pins map_data/M_AXIS] [get_bd_intf_pins pulse_fir/S_AXIS_DATA]
connect_bd_intf_net [get_bd_intf_pins coef] [get_bd_intf_pins pulse_fir/S_AXIS_RELOAD]
connect_bd_intf_net [get_bd_intf_pins map_fsel/M_AXIS] [get_bd_intf_pins pulse_fir/S_AXIS_CONFIG]
connect_bd_intf_net [get_bd_intf_pins o_data] [get_bd_intf_pins trim_data/M_AXIS]
connect_bd_intf_net [get_bd_intf_pins bcast/M00_AXIS] [get_bd_intf_pins map_data/S_AXIS]
connect_bd_intf_net [get_bd_intf_pins pulse_fir/M_AXIS_DATA] [get_bd_intf_pins trim_data/S_AXIS]
connect_bd_intf_net [get_bd_intf_pins i_data] [get_bd_intf_pins bcast/S_AXIS]
connect_bd_intf_net [get_bd_intf_pins map_fsel/S_AXIS] [get_bd_intf_pins bcast/M01_AXIS]
connect_bd_net -net s_axis_adc_pdti_aclk_1 [get_bd_pins aclk] \
  [get_bd_pins bcast/aclk] [get_bd_pins map_fsel/aclk] [get_bd_pins trim_data/aclk] [get_bd_pins map_data/aclk] \
  [get_bd_pins pulse_fir/aclk]
connect_bd_net -net s_axis_adc_pdti_aresetn_1 [get_bd_pins aresetn] \
  [get_bd_pins bcast/aresetn] [get_bd_pins map_fsel/aresetn] [get_bd_pins trim_data/aresetn] [get_bd_pins map_data/aresetn] \
  [get_bd_pins pulse_fir/aresetn]

current_bd_instance /dsp_ch2
connect_bd_intf_net [get_bd_intf_pins coef] [get_bd_intf_pins fir/coef]
connect_bd_intf_net [get_bd_intf_pins metadata_injector/o_data] [get_bd_intf_pins remove_unused_sigs/S_AXIS]
connect_bd_intf_net [get_bd_intf_pins in_pdti] [get_bd_intf_pins fifo/S_AXIS]
connect_bd_intf_net [get_bd_intf_pins fir/o_data] [get_bd_intf_pins metadata_injector/i_data]
connect_bd_intf_net [get_bd_intf_pins out_pdti] [get_bd_intf_pins remove_unused_sigs/M_AXIS]
connect_bd_intf_net [get_bd_intf_pins fifo/M_AXIS] [get_bd_intf_pins fir/i_data]
connect_bd_intf_net [get_bd_intf_pins pulse_metadata] [get_bd_intf_pins metadata_injector/pulse_metadata_V]
connect_bd_net -net s_axis_adc_pdti_aclk_1 [get_bd_pins aclk] \
  [get_bd_pins fir/aclk] [get_bd_pins remove_unused_sigs/aclk] [get_bd_pins fifo/s_axis_aclk] \
  [get_bd_pins metadata_injector/ap_clk]
connect_bd_net -net s_axis_adc_pdti_aresetn_1 [get_bd_pins aresetn] \
  [get_bd_pins fir/aresetn] [get_bd_pins remove_unused_sigs/aresetn] [get_bd_pins fifo/s_axis_aresetn] \
  [get_bd_pins metadata_injector/ap_rst_n]
connect_bd_net [get_bd_pins one/dout] [get_bd_pins metadata_injector/ap_start]
connect_bd_net -net pos_enc_0_1 [get_bd_pins pos_enc_0] [get_bd_pins metadata_injector/pos_enc_0]
connect_bd_net -net pos_enc_1_1 [get_bd_pins pos_enc_1] [get_bd_pins metadata_injector/pos_enc_1]
connect_bd_net [get_bd_pins flags] [get_bd_pins metadata_injector/flags]

current_bd_instance /dsp_ch2/fir
connect_bd_intf_net [get_bd_intf_pins pulse_fir/M_AXIS_DATA] [get_bd_intf_pins trim_data/S_AXIS]
connect_bd_intf_net [get_bd_intf_pins map_fsel/M_AXIS] [get_bd_intf_pins pulse_fir/S_AXIS_CONFIG]
connect_bd_intf_net [get_bd_intf_pins map_fsel/S_AXIS] [get_bd_intf_pins bcast/M01_AXIS]
connect_bd_intf_net [get_bd_intf_pins o_data] [get_bd_intf_pins trim_data/M_AXIS]
connect_bd_intf_net [get_bd_intf_pins map_data/M_AXIS] [get_bd_intf_pins pulse_fir/S_AXIS_DATA]
connect_bd_intf_net [get_bd_intf_pins i_data] [get_bd_intf_pins bcast/S_AXIS]
connect_bd_intf_net [get_bd_intf_pins bcast/M00_AXIS] [get_bd_intf_pins map_data/S_AXIS]
connect_bd_intf_net [get_bd_intf_pins coef] [get_bd_intf_pins pulse_fir/S_AXIS_RELOAD]
connect_bd_net -net s_axis_adc_pdti_aclk_1 [get_bd_pins aclk] \
  [get_bd_pins trim_data/aclk] [get_bd_pins bcast/aclk] [get_bd_pins map_fsel/aclk] [get_bd_pins map_data/aclk] \
  [get_bd_pins pulse_fir/aclk]
connect_bd_net -net s_axis_adc_pdti_aresetn_1 [get_bd_pins aresetn] \
  [get_bd_pins trim_data/aresetn] [get_bd_pins bcast/aresetn] [get_bd_pins map_fsel/aresetn] [get_bd_pins map_data/aresetn] \
  [get_bd_pins pulse_fir/aresetn]

current_bd_instance /controller
connect_bd_intf_net [get_bd_intf_pins coef_ch1] [get_bd_intf_pins validate_kludge_1/M_AXIS]
connect_bd_intf_net [get_bd_intf_pins pulse_metadata_ch1] [get_bd_intf_pins hcr_controller_0/pulse_metadata_ch1_V]
connect_bd_intf_net [get_bd_intf_pins hcr_controller_0/coef_ch0_V_V] [get_bd_intf_pins validate_kludge_0/S_AXIS]
connect_bd_intf_net [get_bd_intf_pins coef_ch2] [get_bd_intf_pins validate_kludge_2/M_AXIS]
connect_bd_intf_net [get_bd_intf_pins coef_ch0] [get_bd_intf_pins validate_kludge_0/M_AXIS]
connect_bd_intf_net [get_bd_intf_pins s_axi_cfg_bus] [get_bd_intf_pins hcr_controller_0/s_axi_cfg_bus]
connect_bd_intf_net [get_bd_intf_pins validate_kludge_1/S_AXIS] [get_bd_intf_pins hcr_controller_0/coef_ch1_V_V]
connect_bd_intf_net [get_bd_intf_pins pulse_metadata_ch2] [get_bd_intf_pins hcr_controller_0/pulse_metadata_ch2_V]
connect_bd_intf_net [get_bd_intf_pins validate_kludge_2/S_AXIS] [get_bd_intf_pins hcr_controller_0/coef_ch2_V_V]
connect_bd_intf_net [get_bd_intf_pins pulse_metadata_ch0] [get_bd_intf_pins hcr_controller_0/pulse_metadata_ch0_V]
connect_bd_net -net s_axis_adc_pdti_aclk_1 [get_bd_pins adc_aclk] \
  [get_bd_pins validate_kludge_0/aclk] [get_bd_pins validate_kludge_1/aclk] [get_bd_pins validate_kludge_2/aclk] \
  [get_bd_pins hcr_controller_0/ap_clk]
connect_bd_net -net reset_reg_aresetn [get_bd_pins aresetn] \
  [get_bd_pins validate_kludge_0/aresetn] [get_bd_pins validate_kludge_1/aresetn] [get_bd_pins validate_kludge_2/aresetn] \
  [get_bd_pins hcr_controller_0/ap_rst_n]
connect_bd_net -net sync_pulse_1 [get_bd_pins controller_PPS] [get_bd_pins hcr_controller_0/pps_q0]
connect_bd_net [get_bd_pins enable_mux_0/O] [get_bd_pins mt_pulse]
connect_bd_net [get_bd_pins hcr_controller_0/mt_pulse_V] [get_bd_pins enable_mux_0/I]
connect_bd_net -net controller_running [get_bd_pins hcr_controller_0/mt_pulse_V_ap_vld] [get_bd_pins enable_mux_0/EN] [get_bd_pins controller_running]
connect_bd_net [get_bd_pins enable_mux_1/O] [get_bd_pins control_flags]
connect_bd_net [get_bd_pins hcr_controller_0/control_flags_V] [get_bd_pins enable_mux_1/I]
connect_bd_net [get_bd_pins hcr_controller_0/control_flags_V_ap_vld] [get_bd_pins enable_mux_1/EN]
connect_bd_net [get_bd_pins hcr_controller_0/filter_select_ch0_V] [get_bd_pins filter_select_ch0]
connect_bd_net [get_bd_pins hcr_controller_0/filter_select_ch1_V] [get_bd_pins filter_select_ch1]
connect_bd_net [get_bd_pins hcr_controller_0/filter_select_ch2_V] [get_bd_pins filter_select_ch2]
connect_bd_net -net control_hvn [get_bd_pins hcr_controller_0/control_hvn] [get_bd_pins control_hvn]

current_bd_instance /csr
connect_bd_intf_net [get_bd_intf_pins s_axi_csr] [get_bd_intf_pins axi_interc/S00_AXI]
connect_bd_intf_net [get_bd_intf_pins adc_csr] [get_bd_intf_pins axi_interc/M01_AXI]
connect_bd_intf_net [get_bd_intf_pins general_purpose_reg_0/s_axi_csr] [get_bd_intf_pins axi_interc/M00_AXI]
connect_bd_net [get_bd_pins xlconstant_0/dout] \
  [get_bd_pins general_purpose_reg_0/reg0_init_val] [get_bd_pins general_purpose_reg_0/reg1_init_val] \
  [get_bd_pins general_purpose_reg_0/reg2_init_val] [get_bd_pins general_purpose_reg_0/reg3_init_val]
connect_bd_net [get_bd_pins s_axis_adc_pdti_aclk] \
  [get_bd_pins axi_interc/M00_ACLK] [get_bd_pins axi_interc/M01_ACLK] [get_bd_pins general_purpose_reg_0/s_axi_csr_aclk]
connect_bd_net [get_bd_pins s_axis_adc_pdti_aresetn] \
  [get_bd_pins axi_interc/M00_ARESETN] [get_bd_pins axi_interc/M01_ARESETN] \
  [get_bd_pins general_purpose_reg_0/s_axi_csr_aresetn]
connect_bd_net -net aresetn_1 [get_bd_pins px_vctr2scalar_0/output_scalar] [get_bd_pins adc_aresetn]
connect_bd_net [get_bd_pins s_axi_csr_aclk] [get_bd_pins axi_interc/ACLK] [get_bd_pins axi_interc/S00_ACLK]
connect_bd_net [get_bd_pins s_axi_csr_aresetn] [get_bd_pins axi_interc/ARESETN] [get_bd_pins axi_interc/S00_ARESETN]
connect_bd_net [get_bd_pins xlslice_0/Dout] [get_bd_pins px_vctr2scalar_0/input_vector]
connect_bd_net -net reset_reg_0_ctl0_out [get_bd_pins general_purpose_reg_0/ctl0_out] [get_bd_pins xlslice_0/Din]
connect_bd_net [get_bd_pins general_purpose_reg_0/ctl1_out] [get_bd_pins xlslice_1/Din]
connect_bd_net [get_bd_pins px_vctr2scalar_1/output_scalar] [get_bd_pins controller_PPS]
connect_bd_net -net i_controller_PPS_1 [get_bd_pins PPS_to_controller] [get_bd_pins util_vector_logic_0/Op2]
connect_bd_net [get_bd_pins xlslice_1/Dout] [get_bd_pins util_vector_logic_0/Op1]
connect_bd_net [get_bd_pins util_vector_logic_0/Res] [get_bd_pins px_vctr2scalar_1/input_vector]
connect_bd_net [get_bd_pins general_purpose_reg_0/ctl2_out] [get_bd_pins ctl2_out]
connect_bd_net [get_bd_pins general_purpose_reg_0/ctl3_out] [get_bd_pins ctl3_out]

current_bd_instance /dsp_ch1
connect_bd_intf_net [get_bd_intf_pins metadata_injector/o_data] [get_bd_intf_pins remove_unused_sigs/S_AXIS]
connect_bd_intf_net [get_bd_intf_pins coef] [get_bd_intf_pins fir/coef]
connect_bd_intf_net [get_bd_intf_pins out_pdti] [get_bd_intf_pins remove_unused_sigs/M_AXIS]
connect_bd_intf_net [get_bd_intf_pins fifo/M_AXIS] [get_bd_intf_pins fir/i_data]
connect_bd_intf_net [get_bd_intf_pins pulse_metadata] [get_bd_intf_pins metadata_injector/pulse_metadata_V]
connect_bd_intf_net [get_bd_intf_pins fir/o_data] [get_bd_intf_pins metadata_injector/i_data]
connect_bd_intf_net [get_bd_intf_pins in_pdti] [get_bd_intf_pins fifo/S_AXIS]
connect_bd_net -net s_axis_adc_pdti_aclk_1 [get_bd_pins aclk] \
  [get_bd_pins fir/aclk] [get_bd_pins remove_unused_sigs/aclk] [get_bd_pins fifo/s_axis_aclk] \
  [get_bd_pins metadata_injector/ap_clk]
connect_bd_net -net s_axis_adc_pdti_aresetn_1 [get_bd_pins aresetn] \
  [get_bd_pins fir/aresetn] [get_bd_pins remove_unused_sigs/aresetn] [get_bd_pins fifo/s_axis_aresetn] \
  [get_bd_pins metadata_injector/ap_rst_n]
connect_bd_net [get_bd_pins one/dout] [get_bd_pins metadata_injector/ap_start]
connect_bd_net -net pos_enc_0_1 [get_bd_pins pos_enc_0] [get_bd_pins metadata_injector/pos_enc_0]
connect_bd_net -net pos_enc_1_1 [get_bd_pins pos_enc_1] [get_bd_pins metadata_injector/pos_enc_1]
connect_bd_net [get_bd_pins flags] [get_bd_pins metadata_injector/flags]

current_bd_instance /dsp_ch1/fir
connect_bd_intf_net [get_bd_intf_pins map_fsel/S_AXIS] [get_bd_intf_pins bcast/M01_AXIS]
connect_bd_intf_net [get_bd_intf_pins i_data] [get_bd_intf_pins bcast/S_AXIS]
connect_bd_intf_net [get_bd_intf_pins o_data] [get_bd_intf_pins trim_data/M_AXIS]
connect_bd_intf_net [get_bd_intf_pins bcast/M00_AXIS] [get_bd_intf_pins map_data/S_AXIS]
connect_bd_intf_net [get_bd_intf_pins map_fsel/M_AXIS] [get_bd_intf_pins pulse_fir/S_AXIS_CONFIG]
connect_bd_intf_net [get_bd_intf_pins coef] [get_bd_intf_pins pulse_fir/S_AXIS_RELOAD]
connect_bd_intf_net [get_bd_intf_pins map_data/M_AXIS] [get_bd_intf_pins pulse_fir/S_AXIS_DATA]
connect_bd_intf_net [get_bd_intf_pins pulse_fir/M_AXIS_DATA] [get_bd_intf_pins trim_data/S_AXIS]
connect_bd_net -net s_axis_adc_pdti_aclk_1 [get_bd_pins aclk] \
  [get_bd_pins trim_data/aclk] [get_bd_pins bcast/aclk] [get_bd_pins map_fsel/aclk] [get_bd_pins map_data/aclk] \
  [get_bd_pins pulse_fir/aclk]
connect_bd_net -net s_axis_adc_pdti_aresetn_1 [get_bd_pins aresetn] \
  [get_bd_pins trim_data/aresetn] [get_bd_pins bcast/aresetn] [get_bd_pins map_fsel/aresetn] [get_bd_pins map_data/aresetn] \
  [get_bd_pins pulse_fir/aresetn]

current_bd_instance /
connect_bd_intf_net [get_bd_intf_ports m_axis_adc_ch2_pdti] [get_bd_intf_pins dsp_ch2/out_pdti]
connect_bd_intf_net [get_bd_intf_ports m_axis_dac_pdti] [get_bd_intf_pins axis_register_slice_0/M_AXIS]
connect_bd_intf_net [get_bd_intf_pins csr/adc_csr] [get_bd_intf_pins controller/s_axi_cfg_bus]
connect_bd_intf_net [get_bd_intf_ports s_axi_csr] [get_bd_intf_pins csr/s_axi_csr]
connect_bd_intf_net [get_bd_intf_ports s_axis_adc_ch1_pdti] [get_bd_intf_pins dsp_ch1/in_pdti]
connect_bd_intf_net [get_bd_intf_pins controller/pulse_metadata_ch2] [get_bd_intf_pins dsp_ch2/pulse_metadata]
connect_bd_intf_net [get_bd_intf_ports s_axis_dac_pdti] [get_bd_intf_pins axis_register_slice_0/S_AXIS]
connect_bd_intf_net [get_bd_intf_ports s_axis_adc_ch0_pdti] [get_bd_intf_pins dsp_ch0/in_pdti]
connect_bd_intf_net [get_bd_intf_ports m_axis_adc_ch1_pdti] [get_bd_intf_pins dsp_ch1/out_pdti]
connect_bd_intf_net [get_bd_intf_ports s_axis_adc_ch2_pdti] [get_bd_intf_pins dsp_ch2/in_pdti]
connect_bd_intf_net [get_bd_intf_pins controller/pulse_metadata_ch0] [get_bd_intf_pins dsp_ch0/pulse_metadata]
connect_bd_intf_net [get_bd_intf_pins controller/coef_ch2] [get_bd_intf_pins dsp_ch2/coef]
connect_bd_intf_net [get_bd_intf_ports m_axis_adc_ch0_pdti] [get_bd_intf_pins dsp_ch0/out_pdti]
connect_bd_intf_net [get_bd_intf_pins dsp_ch1/pulse_metadata] [get_bd_intf_pins controller/pulse_metadata_ch1]
connect_bd_intf_net [get_bd_intf_pins dsp_ch1/coef] [get_bd_intf_pins controller/coef_ch1]
connect_bd_intf_net [get_bd_intf_pins controller/coef_ch0] [get_bd_intf_pins dsp_ch0/coef]
connect_bd_net -net xlconstant_0_dout [get_bd_pins irq_placeholder/dout] [get_bd_ports user2_irq]
connect_bd_net [get_bd_ports s_axis_adc_pdti_aclk] \
  [get_bd_pins position_encoder_0/aclk] [get_bd_pins dsp_ch0/aclk] [get_bd_pins controller/adc_aclk] \
  [get_bd_pins dsp_ch2/aclk] [get_bd_pins csr/s_axis_adc_pdti_aclk] [get_bd_pins dsp_ch1/aclk]
connect_bd_net -net hcr_controller_0_filter_select_ch0 [get_bd_pins controller/filter_select_ch0] [get_bd_ports filter_select_ch0]
connect_bd_net -net hcr_controller_0_filter_select_ch1 [get_bd_pins controller/filter_select_ch1] [get_bd_ports filter_select_ch1]
connect_bd_net -net hcr_controller_0_filter_select_ch2 [get_bd_pins controller/filter_select_ch2] [get_bd_ports filter_select_ch2]
connect_bd_net -net hcr_controller_0_control_flags [get_bd_pins controller/control_flags] [get_bd_ports control_flags]
connect_bd_net -net hcr_controller_0_mt_pulse [get_bd_pins controller/mt_pulse] [get_bd_ports mt_pulse]
connect_bd_net -net pos_enc_0_1 [get_bd_pins position_encoder_0/pos_enc_0] \
  [get_bd_pins dsp_ch0/pos_enc_0] [get_bd_pins dsp_ch2/pos_enc_0] [get_bd_pins dsp_ch1/pos_enc_0]
connect_bd_net -net pos_enc_1_1 [get_bd_pins position_encoder_0/pos_enc_1] \
  [get_bd_pins dsp_ch0/pos_enc_1] [get_bd_pins dsp_ch2/pos_enc_1] [get_bd_pins dsp_ch1/pos_enc_1]
connect_bd_net [get_bd_ports status_flags] [get_bd_pins dsp_ch0/flags] [get_bd_pins dsp_ch2/flags] [get_bd_pins dsp_ch1/flags]
connect_bd_net -net adc_aresetn [get_bd_pins csr/adc_aresetn] \
  [get_bd_pins position_encoder_0/aresetn] [get_bd_pins dsp_ch0/aresetn] [get_bd_pins controller/aresetn] \
  [get_bd_pins dsp_ch2/aresetn] [get_bd_pins dsp_ch1/aresetn]
connect_bd_net [get_bd_ports s_axis_adc_pdti_aresetn] [get_bd_pins csr/s_axis_adc_pdti_aresetn]
connect_bd_net [get_bd_ports s_axi_csr_aresetn] [get_bd_pins csr/s_axi_csr_aresetn]
connect_bd_net [get_bd_ports s_axi_csr_aclk] [get_bd_pins csr/s_axi_csr_aclk]
connect_bd_net -net controller_PPS_1 [get_bd_pins csr/controller_PPS] [get_bd_pins controller/controller_PPS]
connect_bd_net -net controller_PPS_2 [get_bd_ports PPS_to_controller] [get_bd_pins csr/PPS_to_controller]
connect_bd_net [get_bd_ports AZ_MOSI] [get_bd_pins position_encoder_0/AZ_MOSI]
connect_bd_net [get_bd_ports AZ_SCK] [get_bd_pins position_encoder_0/AZ_SCK]
connect_bd_net [get_bd_ports AZ_SSEL] [get_bd_pins position_encoder_0/AZ_SSEL]
connect_bd_net [get_bd_ports EL_MOSI] [get_bd_pins position_encoder_0/EL_MOSI]
connect_bd_net [get_bd_ports EL_SCK] [get_bd_pins position_encoder_0/EL_SCK]
connect_bd_net [get_bd_ports EL_SSEL] [get_bd_pins position_encoder_0/EL_SSEL]
connect_bd_net [get_bd_ports ROT_A] [get_bd_pins position_encoder_0/ROT_A]
connect_bd_net [get_bd_ports ROT_B] [get_bd_pins position_encoder_0/ROT_B]
connect_bd_net [get_bd_ports TILT_A] [get_bd_pins position_encoder_0/TILT_A]
connect_bd_net [get_bd_ports TILT_B] [get_bd_pins position_encoder_0/TILT_B]
connect_bd_net [get_bd_pins csr/ctl2_out] [get_bd_pins position_encoder_0/ctl_reg]
connect_bd_net [get_bd_ports s_axis_dac_pdti_aclk] [get_bd_pins axis_register_slice_0/aclk]
connect_bd_net [get_bd_ports s_axis_dac_pdti_aresetn] [get_bd_pins axis_register_slice_0/aresetn]
connect_bd_net -net ctl3_out [get_bd_pins csr/ctl3_out] [get_bd_ports ctl3_out]
connect_bd_net -net controller_running [get_bd_pins controller/controller_running] [get_bd_ports controller_running]
connect_bd_net -net control_hvn [get_bd_pins controller/control_hvn] [get_bd_ports control_hvn]

# ---- address map ----
assign_bd_address -offset 0x3800000 -range 4K -target_address_space [get_bd_addr_spaces s_axi_csr] [get_bd_addr_segs csr/general_purpose_reg_0/s_axi_csr/reg0]
assign_bd_address -offset 0x3900000 -range 256K -target_address_space [get_bd_addr_spaces s_axi_csr] [get_bd_addr_segs controller/hcr_controller_0/s_axi_cfg_bus/Reg]

validate_bd_design
save_bd_design
